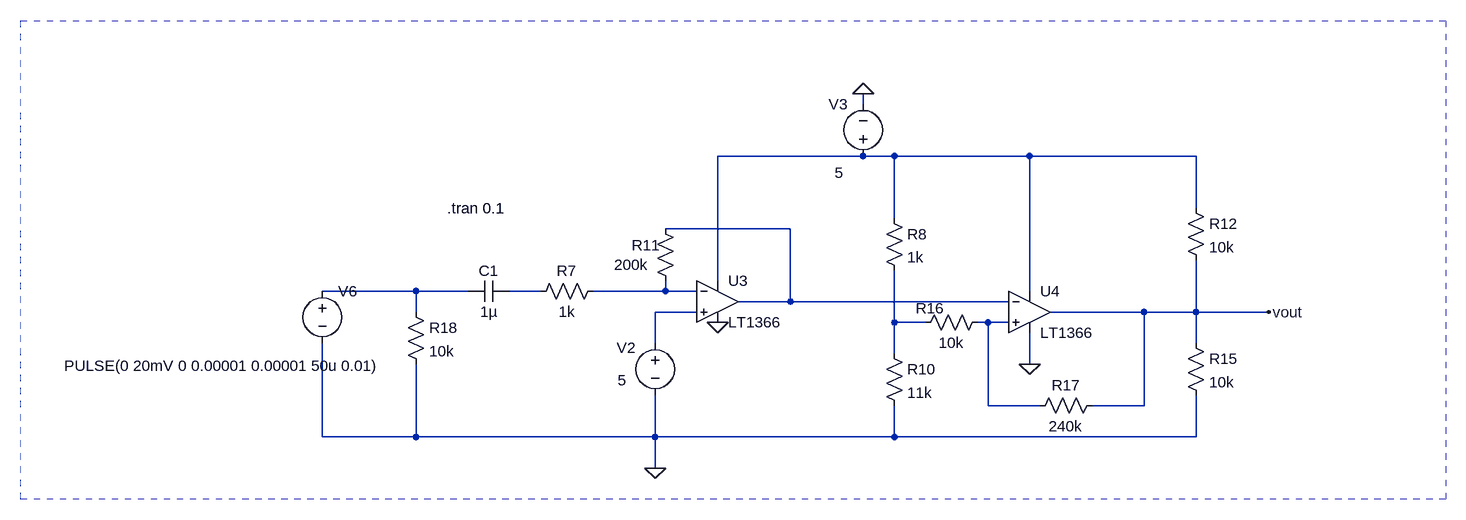
[diagram p0: schematic IR circuit FINAL.asc]
IR circuit FINAL.asc, the LTspice schematic file:
Version 4.1
SHEET 1 2572 2208
WIRE 720 1232 720 1216
WIRE 720 1312 496 1312
WIRE 768 1312 720 1312
WIRE 976 1312 768 1312
WIRE 1232 1312 976 1312
WIRE 1232 1392 1232 1312
WIRE 768 1408 768 1312
WIRE 608 1424 416 1424
WIRE 496 1504 496 1312
WIRE 32 1520 -112 1520
WIRE 112 1520 32 1520
WIRE 224 1520 176 1520
WIRE 416 1520 416 1504
WIRE 416 1520 304 1520
WIRE 464 1520 416 1520
WIRE 976 1520 976 1312
WIRE 608 1536 608 1424
WIRE 608 1536 528 1536
WIRE 944 1536 608 1536
WIRE 32 1552 32 1520
WIRE 464 1552 400 1552
WIRE 1152 1552 1008 1552
WIRE 1232 1552 1232 1472
WIRE 1232 1552 1152 1552
WIRE 1344 1552 1232 1552
WIRE 768 1568 768 1488
WIRE 816 1568 768 1568
WIRE 912 1568 896 1568
WIRE 944 1568 912 1568
WIRE 400 1600 400 1552
WIRE 1232 1600 1232 1552
WIRE 768 1616 768 1568
WIRE 976 1632 976 1584
WIRE 912 1696 912 1568
WIRE 992 1696 912 1696
WIRE 1152 1696 1152 1552
WIRE 1152 1696 1072 1696
WIRE -112 1744 -112 1600
WIRE 32 1744 32 1632
WIRE 32 1744 -112 1744
WIRE 400 1744 400 1680
WIRE 400 1744 32 1744
WIRE 768 1744 768 1696
WIRE 768 1744 400 1744
WIRE 1232 1744 1232 1680
WIRE 1232 1744 768 1744
WIRE 400 1792 400 1744
FLAG 976 1632 0
FLAG 496 1568 0
FLAG 720 1216 0
FLAG 1344 1552 vout
FLAG 400 1792 0
SYMBOL res 320 1504 R90
WINDOW 0 0 56 VBottom 2
WINDOW 3 32 56 VTop 2
SYMATTR InstName R7
SYMATTR Value 1k
SYMBOL voltage 400 1584 R0
WINDOW 123 0 0 Left 0
WINDOW 39 0 0 Left 0
WINDOW 0 -59 23 Left 2
WINDOW 3 -58 73 Left 2
SYMATTR InstName V2
SYMATTR Value 5
SYMBOL cap 176 1504 R90
WINDOW 0 0 32 VBottom 2
WINDOW 3 32 32 VTop 2
SYMATTR InstName C1
SYMATTR Value 1µ
SYMBOL res 752 1392 R0
SYMATTR InstName R8
SYMATTR Value 1k
SYMBOL res 752 1600 R0
SYMATTR InstName R10
SYMATTR Value 11k
SYMBOL voltage 720 1328 R180
WINDOW 0 24 96 Left 2
WINDOW 3 30 -10 Left 2
WINDOW 123 0 0 Left 0
WINDOW 39 0 0 Left 0
SYMATTR InstName V3
SYMATTR Value 5
SYMBOL voltage -112 1504 R0
WINDOW 3 -397 131 Left 2
WINDOW 123 0 0 Left 0
WINDOW 39 0 0 Left 0
SYMATTR Value PULSE(0 20mV 0 0.00001 0.00001 50u 0.01)
SYMATTR InstName V6
SYMBOL res 400 1408 R0
WINDOW 0 -36 41 Left 2
WINDOW 3 -63 71 Left 2
SYMATTR InstName R11
SYMATTR Value 200k
SYMBOL res 1216 1376 R0
SYMATTR InstName R12
SYMATTR Value 10k
SYMBOL res 1216 1584 R0
SYMATTR InstName R15
SYMATTR Value 10k
SYMBOL OpAmps\\LT1366 496 1472 R0
SYMATTR InstName U3
SYMBOL OpAmps\\LT1366 976 1488 R0
SYMATTR InstName U4
SYMBOL res 912 1552 R90
WINDOW 0 10 89 VBottom 2
WINDOW 3 32 56 VTop 2
SYMATTR InstName R16
SYMATTR Value 10k
SYMBOL res 1088 1680 R90
WINDOW 0 0 56 VBottom 2
WINDOW 3 32 56 VTop 2
SYMATTR InstName R17
SYMATTR Value 240k
SYMBOL res 16 1536 R0
SYMATTR InstName R18
SYMATTR Value 10k
TEXT 80 1392 Left 2 !.tran 0.1
RECTANGLE Normal 1616 1840 -576 1104 2

The netlist it stands for:
* IR circuit FINAL.asc
R7 N005 N004 1k
V2 N006 0 5
C1 N004 N003 1µ
R8 N001 N007 1k
R10 N007 0 11k
V3 N001 0 5
V6 N003 0 PULSE(0 20mV 0 0.00001 0.00001 50u 0.01)
R11 N002 N005 200k
R12 N001 vout 10k
R15 vout 0 10k
X§U3 N006 N005 N001 0 N002 LT1366  ; pins In+ In- V+ V- OUT
X§U4 N008 N002 N001 0 vout LT1366  ; pins In+ In- V+ V- OUT
R16 N008 N007 10k
R17 vout N008 240k
R18 N003 0 10k
.tran 0.1
.lib LTC.lib
.backanno
.end